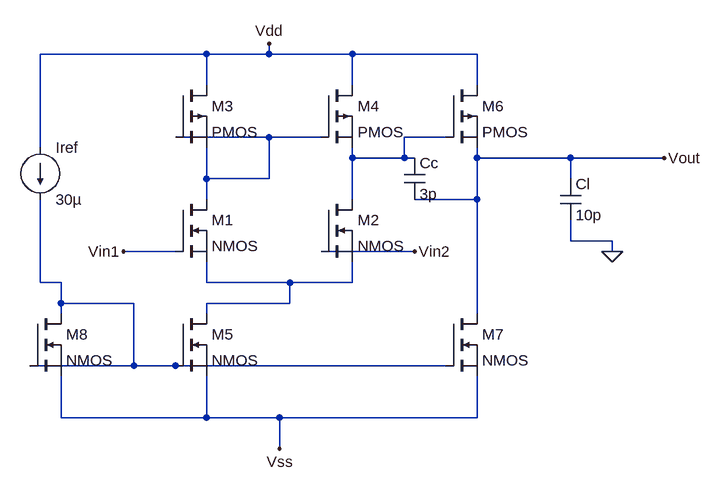
[diagram p0: schematic Two Stage Cmos Amp Basic Layout.asc]
Two Stage Cmos Amp Basic Layout.asc, the LTspice schematic file:
Version 4
SHEET 1 1076 732
WIRE 304 48 48 48
WIRE 400 48 400 32
WIRE 400 48 304 48
WIRE 528 48 400 48
WIRE 720 48 528 48
WIRE 304 96 304 48
WIRE 528 96 528 48
WIRE 720 96 720 48
WIRE 400 176 256 176
WIRE 480 176 400 176
WIRE 672 176 608 176
WIRE 48 192 48 48
WIRE 528 208 528 192
WIRE 608 208 608 176
WIRE 608 208 528 208
WIRE 624 208 608 208
WIRE 720 208 720 192
WIRE 864 208 720 208
WIRE 1008 208 864 208
WIRE 304 240 304 192
WIRE 400 240 400 176
WIRE 400 240 304 240
WIRE 864 240 864 208
WIRE 304 272 304 240
WIRE 528 272 528 208
WIRE 720 272 720 208
WIRE 720 272 624 272
WIRE 864 336 864 304
WIRE 928 336 864 336
WIRE 256 352 176 352
WIRE 624 352 480 352
WIRE 928 352 928 336
WIRE 48 400 48 272
WIRE 80 400 48 400
WIRE 304 400 304 368
WIRE 432 400 304 400
WIRE 528 400 528 368
WIRE 528 400 432 400
WIRE 80 432 80 400
WIRE 192 432 80 432
WIRE 432 432 432 400
WIRE 432 432 304 432
WIRE 80 448 80 432
WIRE 304 448 304 432
WIRE 720 448 720 272
WIRE 192 528 192 432
WIRE 192 528 32 528
WIRE 256 528 192 528
WIRE 672 528 256 528
WIRE 80 608 80 544
WIRE 304 608 304 544
WIRE 304 608 80 608
WIRE 416 608 304 608
WIRE 720 608 720 544
WIRE 720 608 416 608
WIRE 416 656 416 608
FLAG 928 352 0
FLAG 1008 208 Vout
FLAG 176 352 Vin1
FLAG 624 352 Vin2
FLAG 400 32 Vdd
FLAG 416 656 Vss
SYMBOL nmos 256 272 R0
SYMATTR InstName M1
SYMBOL nmos 480 272 R0
SYMATTR InstName M2
SYMBOL nmos 32 448 R0
SYMATTR InstName M8
SYMBOL nmos 256 448 R0
SYMATTR InstName M5
SYMBOL nmos 672 448 R0
SYMATTR InstName M7
SYMBOL pmos 256 96 R0
SYMATTR InstName M3
SYMBOL pmos 480 96 R0
SYMATTR InstName M4
SYMBOL pmos 672 96 R0
SYMATTR InstName M6
SYMBOL current 48 192 R0
SYMATTR InstName Iref
SYMATTR Value 30µ
SYMBOL cap 608 208 R0
SYMATTR InstName Cc
SYMATTR Value 3p
SYMBOL cap 848 240 R0
SYMATTR InstName Cl
SYMATTR Value 10p

The netlist it stands for:
* Two Stage Cmos Amp Basic Layout.asc
M1 N001 Vin1 N004 N004 NMOS
M2 N002 Vin2 N004 N004 NMOS
M8 N003 N003 Vss Vss NMOS
M5 N004 N003 Vss Vss NMOS
M7 Vout N003 Vss Vss NMOS
M3 Vdd N001 N001 N001 PMOS
M4 Vdd N001 N002 N002 PMOS
M6 Vdd N002 Vout Vout PMOS
Iref Vdd N003 30µ
Cc N002 Vout 3p
Cl Vout 0 10p
.model NMOS NMOS
.model PMOS PMOS
.lib standard.mos
.backanno
.end